# EAGLE schematic sonyalpine (EAGLE 7.3.0)
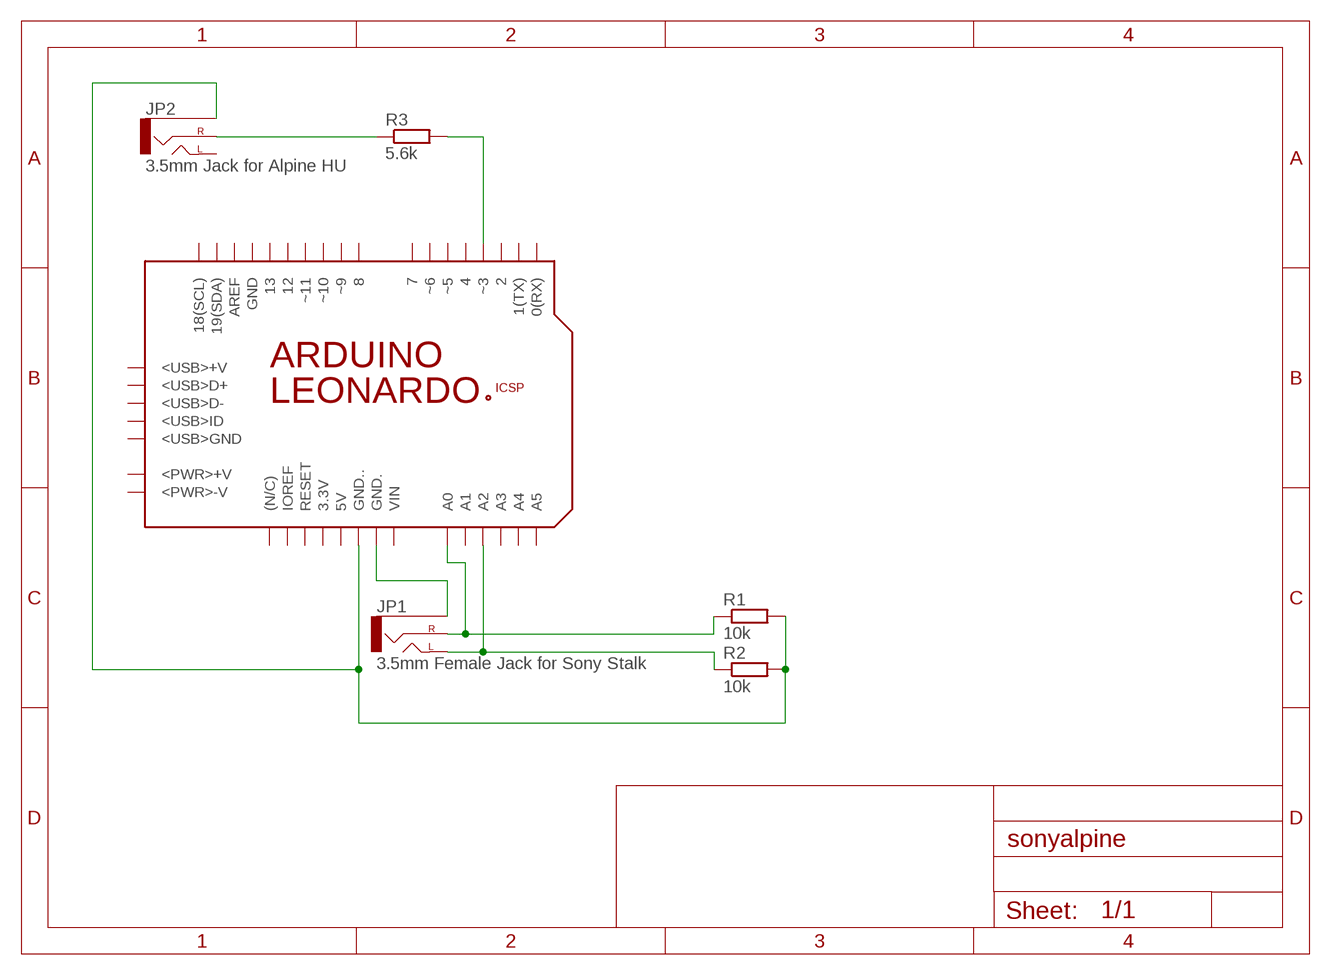
[diagram p0: schematic, sheet 1]

## Parts
JP1  3.5mm Female Jack for Sony Stalk  AUDIO-JACKPTH  [AUDIO-JACK]
JP2  3.5mm Jack for Alpine HU  AUDIO-JACK1:1  [STEREOJACK2.5MM]
PCB1  ARDUINO_LEONARDO_EXT  (no package)
R1  10k  R-EU_0204/7  [0204/7]
R2  10k  R-EU_0204/7  [0204/7]
R3  5.6k  R-EU_0204/7  [0204/7]

## Nets
N$1: JP2.4(RIGHT) R3.1
N$2: JP1.SLEEVE PCB1.GND.
N$3: JP1.RING(RIGHT) PCB1.A0 R1.1
N$4: JP1.TIP(LEFT) PCB1.A2 R2.1
N$5: JP2.5(SLEEVE) PCB1.GND.. R1.2 R2.2
N$6: PCB1.~3 R3.2
Unconnected: JP2.1(LEFT) PCB1.0(RX) PCB1.1(TX) PCB1.2 PCB1.3.3V PCB1.4 PCB1.5V PCB1.7 PCB1.8 PCB1.12 PCB1.13 PCB1.18(SCL) PCB1.19(SDA) PCB1.(N/C) PCB1.+5V PCB1.<PWR>+V PCB1.<PWR>-V PCB1.<USB>+V PCB1.<USB>D+ PCB1.<USB>D- PCB1.<USB>GND PCB1.<USB>ID PCB1.A1 PCB1.A3 PCB1.A4 PCB1.A5 PCB1.AREF PCB1.GND PCB1.GND_ PCB1.IOREF PCB1.MISO PCB1.MOSI PCB1.RESET PCB1.RESET. PCB1.SCK PCB1.VIN PCB1.~5 PCB1.~6 PCB1.~9 PCB1.~10 PCB1.~11

## Library data of the parts
JP1 JP2 = SparkFun-Connectors:AUDIO-JACK: 3.5mm Audio Jack Simple 3.5mm common PCB mount audio jack. Variant PTH is our storefront SKU PRT-08032
PCB1 = E14_Arduino_revB:ARDUINO_LEONARDO_EXT: Device for representing an Arduino Leonardo board in an EAGLE design without the PCB footprint. Created by Dave Young for Element14. More EAGLE documentation at: http://www.element14.com/community/community/knode/cadsoft_eagle
R1 R2 = resistor:R-EU_: RESISTOR, European symbol
R3 = rcl:R-EU_: RESISTOR, European symbol